# EAGLE design zamek (EAGLE 6.4)
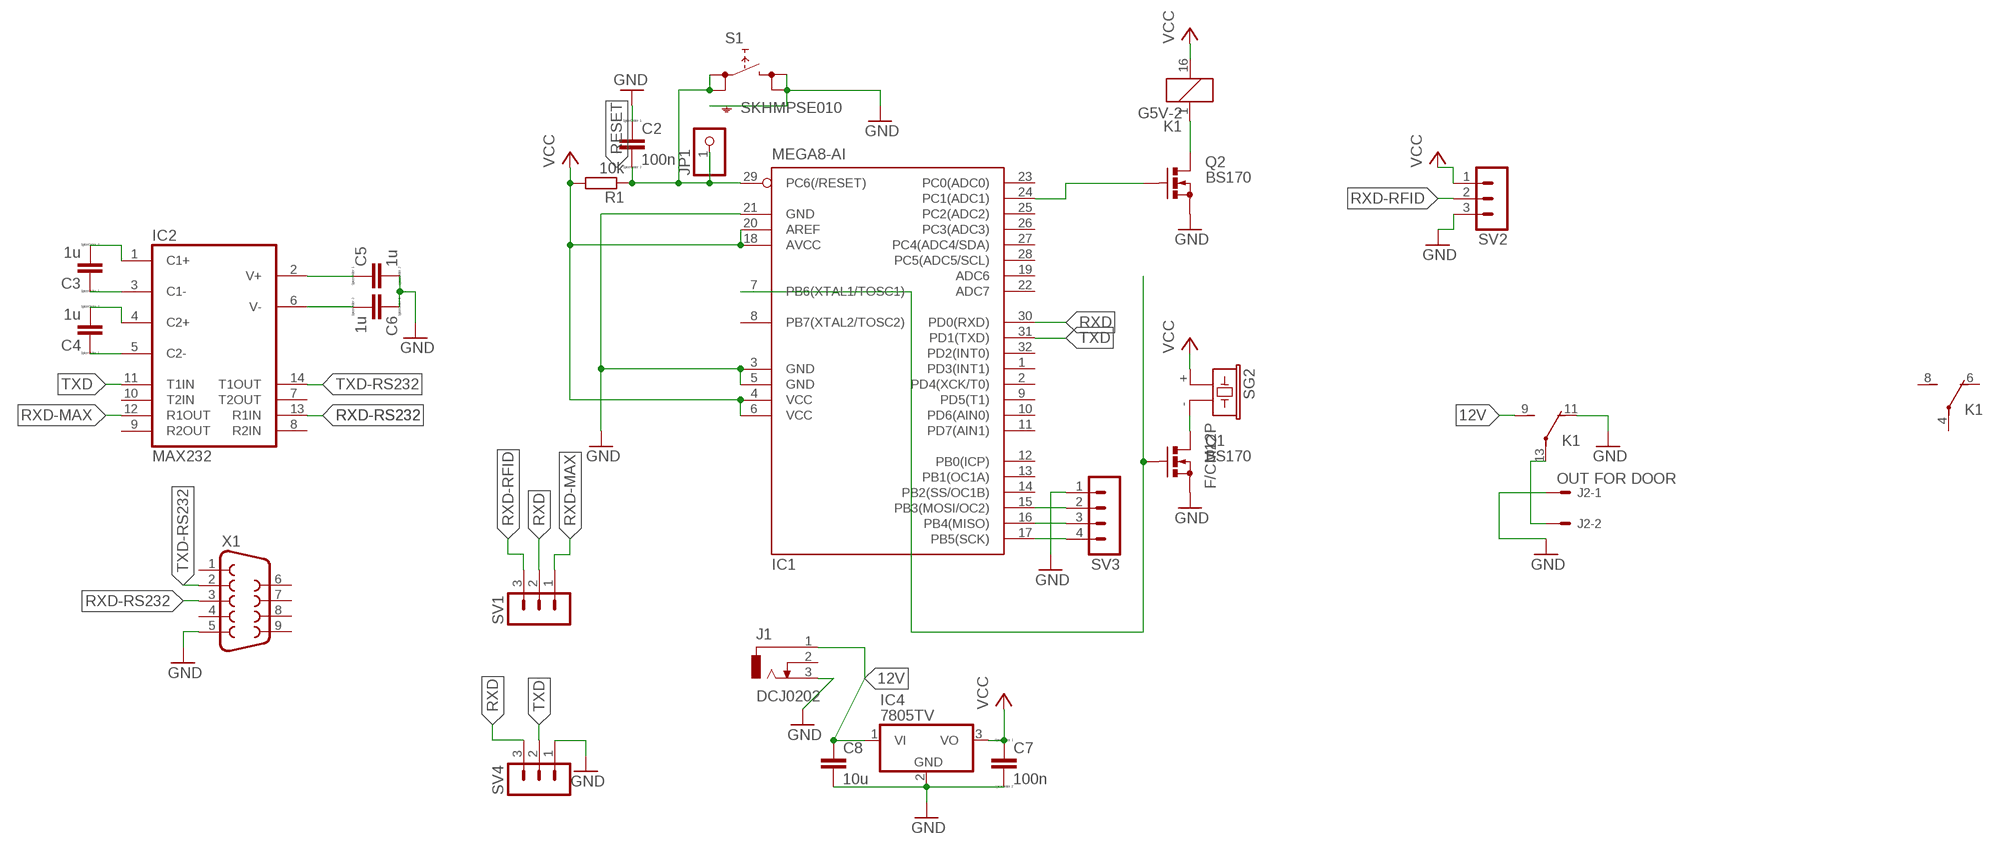
[diagram p0: schematic, sheet 1]

## Parts
C2  100n  CC1206  [C1206]
C3  1u  CC1206  [C1206]
C4  1u  CC1206  [C1206]
C5  1u  CC1206  [C1206]
C6  1u  CC1206  [C1206]
C7  100n  CC1206  [C1206]
C8  10u  C5/3  [C5B3]
IC1  MEGA8-AI  [TQFP32-08]
IC2  MAX232  [DIL16]
IC4  7805TV  [TO220V]
J1  DCJ0202  [DCJ0202]
J2  OUT FOR DOOR  22-27-2021-02  [6410-02]
JP1  PINHD-1X1  [1X01]
K1  G5V-2  [G5V-2]
Q1  BS170  [SOT54E]
Q2  BS170  [SOT54E]
R1  10k  R-EU_R1206  [R1206]
S1  SKHMPSE010  [SKHMPXE010]
SG2  F/CM12P  [F/CM12P]
SV1  MA03-1  [MA03-1]
SV2  MA03-1  [MA03-1]
SV3  MA04-1  [MA04-1]
SV4  MA03-1  [MA03-1]
X1  F09HP  [F09HP]

## Nets
12V: C8.1 IC4.1(VI) J1.1 K1.9(2:S)
GND: C2.1 C5.2 C6.1 C7.2 C8.2 IC1.3(GND) IC1.5(GND) IC1.21(GND) IC4.2(GND) J1.3 J2.1 K1.11(2:O) Q1.S Q2.S S1.3(2.1) S1.4(2.2) S1.5(SH) SV2.3 SV3.1 SV4.1 X1.5
MISO: IC1.16(PB4(MISO)) SV3.3
MOSI: IC1.15(PB3(MOSI/OC2)) SV3.2
N$1: C5.1 IC2.2(V+)
N$2: C6.2 IC2.6(V-)
N$3: C3.1 IC2.3(C1-)
N$4: C4.1 IC2.5(C2-)
N$5: C4.2 IC2.4(C2+)
N$6: C3.2 IC2.1(C1+)
N$7: Q1.D SG2.-
N$8: IC1.24(PC1(ADC1)) Q2.G
N$9: K1.1 Q2.D
N$10: IC1.7(PB6(XTAL1/TOSC1)) Q1.G
N$11: J2.2 K1.13(2:P)
RESET: C2.2 IC1.29(PC6(/RESET)) JP1.1 R1.1 S1.1(1.1) S1.2(1.2)
RXD: IC1.30(PD0(RXD)) SV1.2 SV4.3
RXD-MAX: IC2.12(R1OUT) SV1.1
RXD-RFID: SV1.3 SV2.2
RXD-RS232: IC2.13(R1IN) X1.3
SCK: IC1.17(PB5(SCK)) SV3.4
TXD: IC1.31(PD1(TXD)) IC2.11(T1IN) SV4.2
TXD-RS232: IC2.14(T1OUT) X1.2
VCC: C7.1 IC1.4(VCC) IC1.6(VCC) IC1.18(AVCC) IC1.20(AREF) IC4.3(VO) K1.16 R1.2 SG2.+ SV2.1
Unconnected: IC1.1(PD3(INT1)) IC1.2(PD4(XCK/T0)) IC1.8(PB7(XTAL2/TOSC2)) IC1.9(PD5(T1)) IC1.10(PD6(AIN0)) IC1.11(PD7(AIN1)) IC1.12(PB0(ICP)) IC1.13(PB1(OC1A)) IC1.14(PB2(SS/OC1B)) IC1.19(ADC6) IC1.22(ADC7) IC1.23(PC0(ADC0)) IC1.25(PC2(ADC2)) IC1.26(PC3(ADC3)) IC1.27(PC4(ADC4/SDA)) IC1.28(PC5(ADC5/SCL)) IC1.32(PD2(INT0)) IC2.7(T2OUT) IC2.8(R2IN) IC2.9(R2OUT) IC2.10(T2IN) J1.2 K1.4(1:P) K1.6(1:O) K1.8(1:S) X1.1 X1.4 X1.6 X1.7 X1.8 X1.9

## Power pins joined to a net without a drawn wire
GND: IC2.15(GND)
VCC: IC2.16(VCC)

## Library data of the parts
C2-C7 = eagle-ltspice:C: CAPACITOR, European symbol; SPICEMODEL: NONE; SPICEPREFIX: C
C8 = capacitor-wima:C: CAPACITOR naming: grid - package width
IC1 = atmel:MEGA8: MICROCONTROLLER 8 Kbytes FLASH, 1 kbytes SRAM, 512 bytes EEPROM, USART, 6-channel 10 bit ADC, 2-channel 8 bit ADC Pin compatible with Atmega48, ATMega88, ATMega168 Source: avr.lbr; MPN: ATMEGA8-16AU; OC_FARNELL: 9171371; OC_NEWARK: 73M8863
IC2 = maxim:MAX232: RS232 TRANSEIVER; MF: MAXIM; MPN: MAX232ACPE+; OC_FARNELL: 9723773; OC_NEWARK: 68K4544
IC4 = linear:78*: Positive VOLTAGE REGULATOR Source: http://cache.national.com/ds/LM/LM78L05.pdf http://www.fairchildsemi.com/ds/LM/LM7805.pdf
J1 = con-jack:DCJ0202: DC POWER JACK Source: DCJ0202.pdf; OC_FARNELL: unknown; OC_NEWARK: unknown
J2 = con-molex:22-?-02: CONNECTOR wire to board 2.54 mm (.1 inch) pitch header; OC_FARNELL: unknown; OC_NEWARK: unknown
JP1 = pinhead:PINHD-1X1: PIN HEADER
K1 = relay:G5V-2: OMRON PCB Relay Source: http://www.omron.com/ecb/products/pdf/en-g5v2.pdf; MPN: G5V-2 5DC; OC_FARNELL: 9949488; OC_NEWARK: 78K5703
Q1 Q2 = transistor-small-signal:BS170: N-CHANNEL MOS FET
R1 = rcl:R-EU_: RESISTOR, European symbol
S1 = switch:SKHMP*E010: 6.2 X 6.5mm TACT Switch (SMD) Source: http://www3.alps.co.jp/WebObjects/catalog.woa/PDF/E/Switch/Tact/SKHM/SKHM.PDF
SG2 = buzzer:F/CM12P: BUZZER Source: Buerklin; OC_FARNELL: unknown; OC_NEWARK: unknown
SV1 SV2 SV4 = con-lstb:MA03-1: PIN HEADER; OC_FARNELL: unknown; OC_NEWARK: unknown
SV3 = con-lstb:MA04-1: PIN HEADER; OC_FARNELL: unknown; OC_NEWARK: unknown
X1 = con-subd:F09: SUB-D; OC_FARNELL: unknown; OC_NEWARK: unknown

## Board
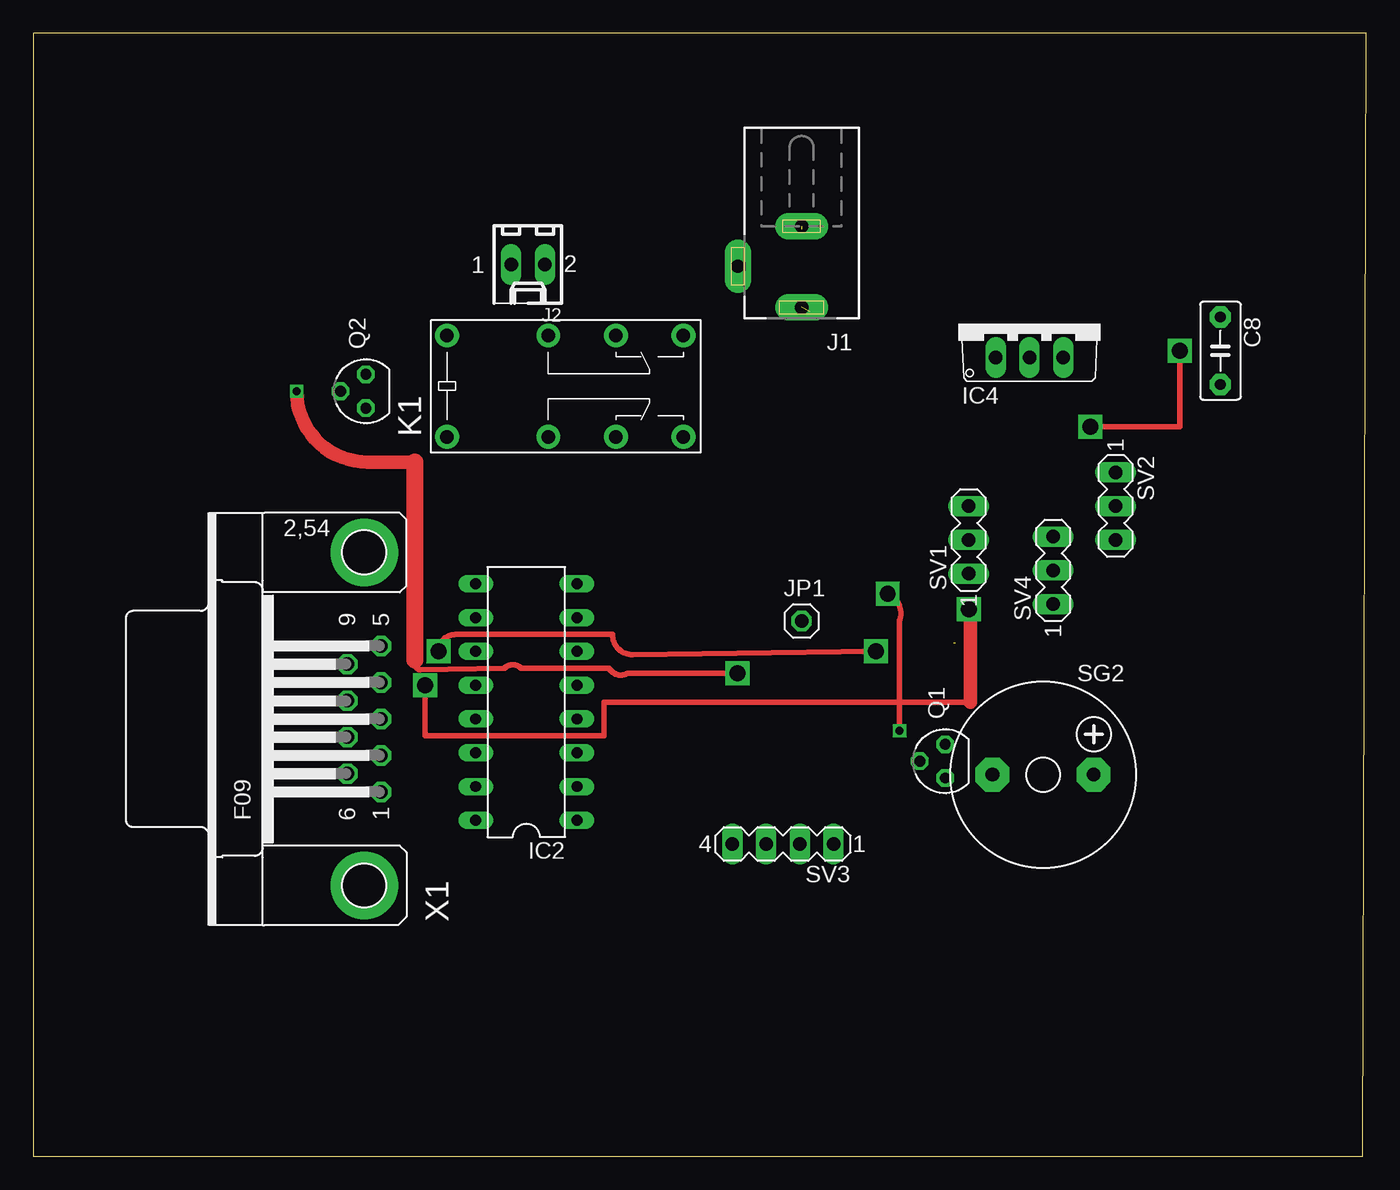
[diagram p1: board, top side]
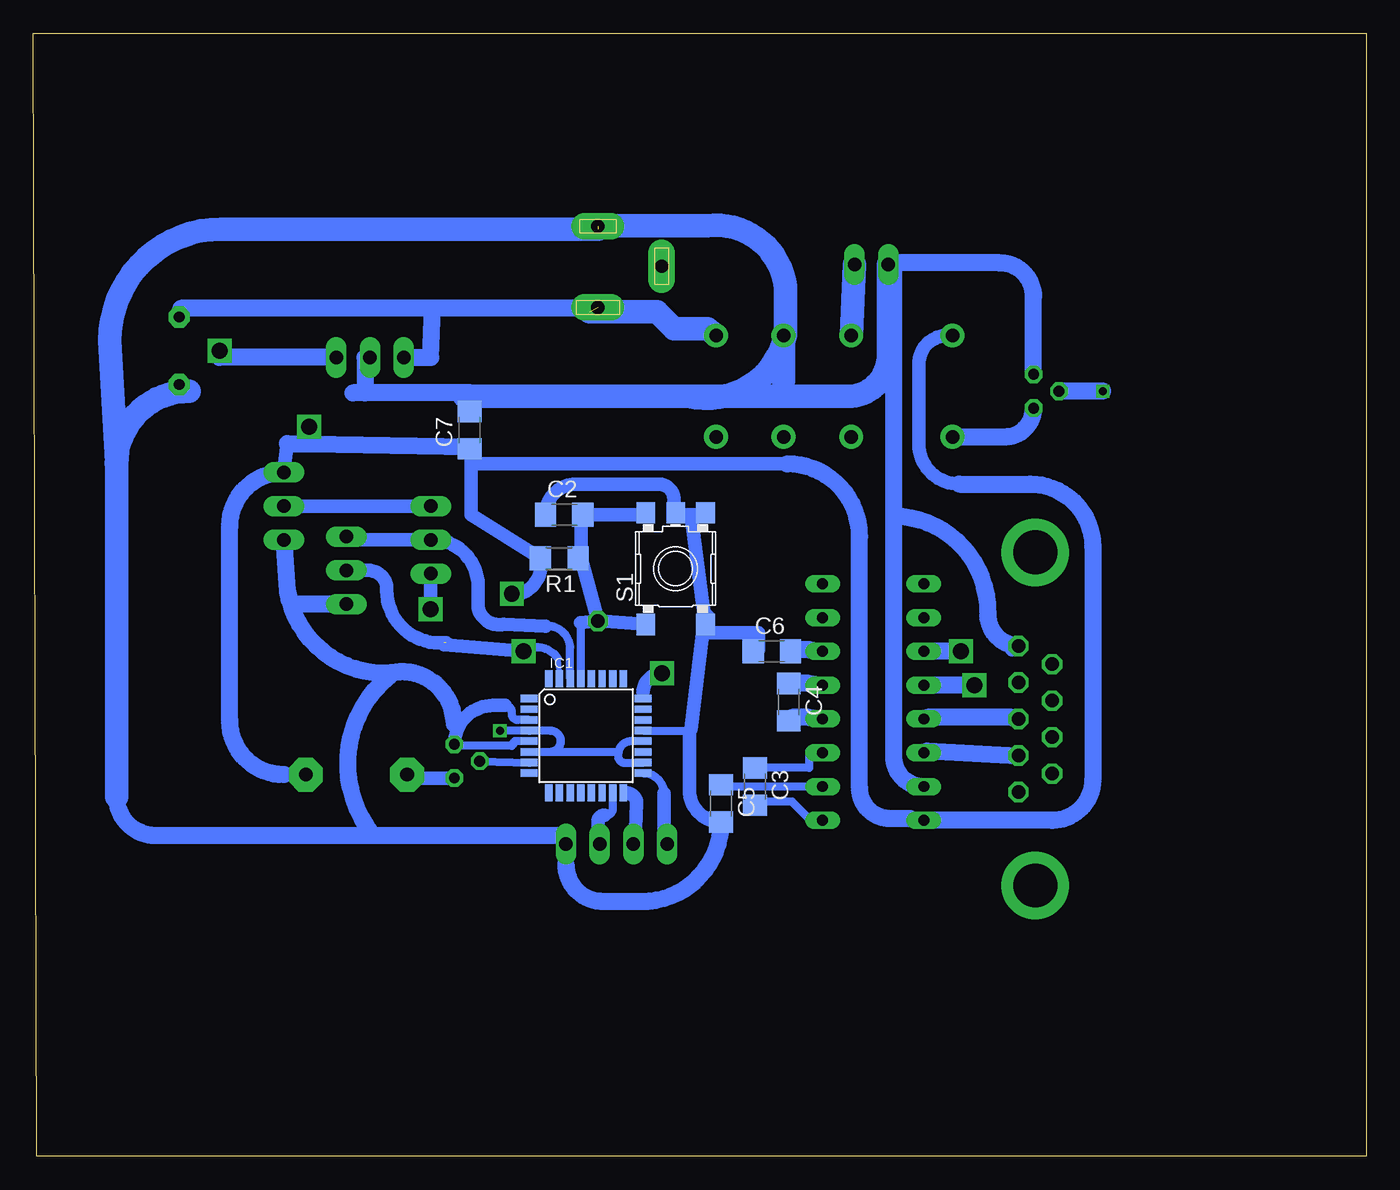
[diagram p2: board, bottom side, seen from below]

Size 100.25 x 84.44 mm. Coordinates in mm from the lower left corner, seen from the top.
Outline: 0,0 100,0 100.25,84.44 0,84.44 0,0
Copper layers (1*16): Top 0.035mm / dielectric 1.5mm / Bottom 0.035mm
Design rules "default *": minimum track width 20mil, minimum drill 24mil, track to track 15mil, track to pad 15mil, pad to pad 15mil, via to via 15mil, smd to smd 8mil, copper to edge 40mil, drill to drill 8mil, minimum pad ring 10mil, minimum via ring 8mil, stop-mask expansion 4mil, vias tented up to drill 0mil, thermal gap 10mil

### Footprints (pad centres in the part's own frame; a part is rotated, then mirrored left to right if it is on the bottom)
C1206 = smd 1.6 x 1.8: 1 -1.4,0; 2 1.4,0
C5B3 = drill 0.813 pad 1.6 octagon: 1 -2.54,0; 2 2.54,0
TQFP32-08 = smd 1.27 x 0.559: 1 -4.293,2.8; 2 -4.293,2; 3 -4.293,1.2; 4 -4.293,0.4; 5 -4.293,-0.4; 6 -4.293,-1.2; 7 -4.293,-2; 8 -4.293,-2.8; 17 4.293,-2.8; 18 4.293,-2; 19 4.293,-1.2; 20 4.293,-0.4; 21 4.293,0.4; 22 4.293,1.2; 23 4.293,2; 24 4.293,2.8 | smd 0.559 x 1.27: 9 -2.8,-4.293; 10 -2,-4.293; 11 -1.2,-4.293; 12 -0.4,-4.293; 13 0.4,-4.293; 14 1.2,-4.293; 15 2,-4.293; 16 2.8,-4.293; 25 2.8,4.293; 26 2,4.293; 27 1.2,4.293; 28 0.4,4.293; 29 -0.4,4.293; 30 -1.2,4.293; 31 -2,4.293; 32 -2.8,4.293
DIL16 = drill 0.813 long: 1 -8.89,-3.81; 2 -6.35,-3.81; 3 -3.81,-3.81; 4 -1.27,-3.81; 5 1.27,-3.81; 6 3.81,-3.81; 7 6.35,-3.81; 8 8.89,-3.81; 9 8.89,3.81; 10 6.35,3.81; 11 3.81,3.81; 12 1.27,3.81; 13 -1.27,3.81; 14 -3.81,3.81; 15 -6.35,3.81; 16 -8.89,3.81
TO220V = drill 1.016 long: 1 -2.54,-2.54; 2 0,-2.54; 3 2.54,-2.54
DCJ0202 = drill 1 pad 2 long: 1 0,3.1; 2 4.8,0; 3 0,-3
6410-02 = drill 1.016 long: 1 1.27,0; 2 -1.27,0
1X01 = drill 1.016 octagon: 1 0,0
G5V-2 = drill 1 pad 1.8: 1 -8.89,-3.81; 4 -1.27,-3.81; 6 3.81,-3.81; 8 8.89,-3.81; 9 8.89,3.81; 11 3.81,3.81; 13 -1.27,3.81; 16 -8.89,3.81
SOT54E = drill 0.813 octagon: D -1.27,0; G 0,1.905; S 1.27,0
R1206 = smd 1.6 x 1.803: 1 -1.422,0; 2 1.422,0
SKHMPXE010 = smd 1.6 x 1.4: 1 -4.2,2.25; 2 4.2,2.25; 3 -4.2,-2.25; 4 4.2,-2.25; 5 4.2,0
F/CM12P = drill 1.016 pad 2.54 octagon: + 3.81,0; - -3.81,0
MA03-1 = drill 1.016 long: 1 -2.54,0; 2 0,0; 3 2.54,0
MA04-1 = drill 1.016 long: 1 -3.81,0; 2 -1.27,0; 3 1.27,0; 4 3.81,0
F09HP = drill 1.016 octagon: 1 -5.486,-1.27; 2 -2.743,-1.27; 3 0,-1.27; 4 2.743,-1.27; 5 5.486,-1.27; 6 -4.115,1.27; 7 -1.372,1.27; 8 1.372,1.27; 9 4.115,1.27 | drill 3.302 pad 5.08: G1 -12.522,0; G2 12.522,0

### Placement (x,y rotation side)
C2  60.33,48.26 0 bottom
C3  45.97,27.81 270 bottom
C4  43.43,34.16 270 bottom
C5  48.51,26.54 270 bottom
C6  44.7,37.97 0 bottom
C7  67.44,54.61 90 bottom
C8  89.28,60.58 270 top
IC1  58.67,31.62 0 bottom
IC2  37.08,34.16 90 top
IC4  74.93,62.61 0 top
J1  57.78,66.93 180 top
J2  37.21,67.06 180 top
JP1  57.78,40.26 0 top
K1  40.01,57.91 0 top
Q1  68.58,29.72 90 top
Q2  25.02,57.53 90 top
R1  60.71,44.96 180 bottom
S1  51.94,44.2 90 bottom
SG2  75.95,28.7 0 top
SV1  70.36,46.35 90 top
SV2  81.41,48.9 270 top
SV3  56.39,23.5 180 top
SV4  76.71,44.07 90 top
X1  24.89,32.89 90 top

### Tracks (layer width: path | path; a pad name or v marks a point on that pad's centre or on a via)
12V  (1 unrouted)
  Bottom 0.406: J1.1 65.79,63.7 57.53,63.75
  Bottom 1.27: 57.53,63.75 70.23,63.75 | 70.23,63.75 89.15,63.75 C8.1 | IC4.1 70.36,60.07 70.23,63.75
  Bottom 1.778: 58.42,63.5 53.34,63.5 52.07,62.23 49.53,62.23 K1.9
GND  (1 unrouted)
  Bottom 0.406: 50.91,32.02 arc-90 50.8,32.13 | 64.26,33.27 64.26,33.4 | 64.03,31.22 arc-90 64.14,31.11 | 64.14,30.99 arc90 64.26,30.86 | 68.45,30.86 arc90 Q1.S 68.58,32.51 | 35.81,67.18 arc-90 J2.1 | 43.81,57.78 arc90 44.45,57.15 | 43.69,58.42 arc-90 43.81,58.29 | IC4.2 75.31,60.07 | 89.28,57.23 C8.2 | 52.58,56.64 53.21,56.64 53.21,57.15 | 67.82,57.15 67.82,57.4 | 58.42,57.15 50.93,57.15 | 57.74,69.98 arc-90 J1.3
  Bottom 0.508: 49.53,39.37 S1.3 | 45.72,38.1 C6.1 | 49.53,48.26 S1.4 | 52.07,48.26 S1.5 | 49.78,40.51 49.53,40.64 | 72.64,36.45 72.39,36.83 | 34.29,27.94 IC2.15 | 26.67,38.1 X1.5 | 48.26,25.4 C5.2
  Bottom 0.61: IC1.21 50.91,32.02 | IC1.3 63.81,32.82 arc90 64.26,33.27 | 64.26,33.4 arc-90 64.77,33.91 | IC1.5 64.03,31.22 | 64.14,31.11 64.14,30.99 | 64.26,30.86 68.45,30.86
  Bottom 1.016: 49.53,39.37 45.72,39.37 45.72,38.1 | 50.8,48.26 52.07,48.26 52.07,49.4 arc-90 53.21,50.55 59.44,50.55 arc-90 C2.1 | 50.8,48.26 49.53,48.26 | 50.8,48.26 49.78,40.51 50.8,32.13 | 49.53,40.64 S1.3 | 35.94,66.93 J2.1 arc90 35.56,66.67 | 64.77,33.91 65.66,33.91 arc-90 Q1.S | 43.81,58.29 43.81,57.78 | 66.48,56.97 arc-90 C7.2 | C7.2 arc-90 67.31,56.14 67.31,57.4 arc-90 67.44,57.28 C7.2 | 50.91,32.02 50.91,27.54 arc-90 C5.2 | 60.2,21.97 SV3.1 60.2,23.88 arc-90 60.45,24.13 | 73.41,36.2 arc32 73.15,36.45 | 73.15,36.45 arc58 72.52,36.45 72.64,36.45 | 72.64,36.45 73.15,36.45 | 73.15,36.45 arc90 72.64,36.45 | 26.67,38.1 26.04,38.35 | 28.45,40.77 28.45,40.89 | 80.64,41.53 arc90 81.15,42.55 | 74.55,24.13 arc-90 74.68,24.13 74.55,24.13 | 88.52,57.53 89.53,57.53 arc-90 89.66,57.4 89.41,57.4 arc90 89.28,57.28 88.77,57.28 arc-90 88.52,57.53
  Bottom 1.27: 35.56,66.67 35.56,48.13 | 68.58,32.51 arc-90 72.64,36.45 arc90 81.15,42.55 SV2.3 | Q2.S 25.02,64.64 arc-90 27.56,67.18 35.81,67.18 | 74.68,24.13 91.06,24.13 arc90 93.98,27.05 | C8.2 88.52,57.53 | 67.31,57.4 67.82,57.4 75.31,57.4 | 75.31,57.4 76.2,57.4 | 60.2,21.97 arc-90 57.4,19.18 54.48,19.18 arc-90 C5.2 | 60.45,24.13 74.68,24.13 | 74.68,24.13 arc90 73.41,36.2 | 26.04,38.35 arc90 28.45,40.77 | 28.45,40.89 arc-90 35.56,48.13 | SV4.1 80.64,41.53 | 35.56,48.13 35.56,30.1 arc-90 IC2.15 | 75.31,60.07 75.31,57.4
  Bottom 1.778: 50.93,57.15 44.45,57.15 38.99,57.15 arc-90 35.94,60.2 J2.1 | 50.93,57.15 53.21,57.15 58.42,57.15 67.82,57.15 | K1.11 43.81,58.29 | 93.98,27.05 93.98,52.07 | 93.98,52.07 arc90 88.52,57.53 | 50.93,57.15 arc-90 43.69,61.72 43.69,65.41 arc-90 49.53,69.98 57.74,69.98 | 57.78,69.72 86.11,69.72 arc-90 94.49,61.34 93.98,52.2 arc-90 93.98,52.07
MISO
  Bottom 0.406: IC1.16 55.65,27.33 | 54.99,23.62 arc90 SV3.3
  Bottom 1.016: 55.65,27.33 arc90 54.86,26.54 54.99,23.62
MOSI
  Bottom 0.406: 57.15,25.65 57.28,25.65 | 57.78,23.62 arc-90 SV3.2
  Bottom 0.61: IC1.15 56.67,26.13 arc90 57.15,25.65
  Bottom 1.016: 57.28,25.65 arc-90 57.78,25.15 57.78,23.62
N$1
  Bottom 0.61: IC2.2 48.38,27.81 arc90 C5.1
N$2
  Bottom 0.508: 43.18,38.1 C6.2
  Bottom 1.27: 43.18,38.1 41.91,38.1 IC2.6
N$3
  Bottom 0.508: 45.72,29.21 C3.1 | 41.91,30.48 IC2.3
  Bottom 0.61: 41.91,30.48 41.91,29.21 45.72,29.21
N$4
  Bottom 0.508: 43.18,35.56 C4.1
  Bottom 1.27: 43.18,35.56 41.91,35.56 IC2.5
N$5
  Bottom 0.508: 43.18,33.02 C4.2
  Bottom 1.27: 43.18,33.02 41.91,33.02 IC2.4
N$6
  Bottom 0.508: 45.72,26.67 C3.2 | 41.91,25.4 IC2.1
  Bottom 0.61: 45.72,26.67 43.18,26.67 41.91,25.4
N$7
  Bottom 1.016: Q1.D 72.14,28.45 SG2.-
N$8  (via drill 0.6, 1.2)
  Top 0.406: v52.96,36.32 44.7,36.32 arc-90 43.31,36.7 36.7,36.7 arc90 35.43,36.7 29.08,36.58 arc-90 28.7,37.34
  Top 1.016: 28.7,52.2 25.15,52.2 arc-90 v19.81,57.53
  Top 1.27: 28.7,37.34 28.7,52.2
  Bottom 0.61: IC1.24 54.38,34.9
  Bottom 1.016: 54.38,34.9 arc90 v52.96,36.32
  Bottom 1.27: v19.81,57.53 Q2.G
N$9
  Bottom 1.27: K1.1 27.18,54.1 arc-90 Q2.D
N$10
  Bottom 0.406: 62.94,29.59 arc90 IC1.7
  Bottom 0.61: Q1.G 62.94,29.59
N$11
  Bottom 1.778: K1.13 J2.2
RESET
  Bottom 0.508: 54.61,48.26 S1.2 | 54.23,40.01 S1.1 | 59.05,48.26 C2.2 | 59.05,44.96 R1.1
  Bottom 0.61: 59.07,40.11 IC1.29
  Bottom 1.016: JP1.1 59.07,40.11 | C2.2 54.61,48.26 | JP1.1 54.23,40.01 | JP1.1 59.05,44.96 59.05,48.26
RXD
  Bottom 0.406: SV1.2 70.23,46.35
  Bottom 0.61: IC1.30 59.87,38.28 arc-90 61.72,39.88
  Bottom 1.016: 70.23,46.35 arc90 66.8,42.93 66.8,41.27 arc-90 64.9,40.01 61.72,39.88 | SV1.2 76.45,46.35 arc90 SV4.3
RXD-MAX  (via drill 1.2)
  Top 0.406: v70.36,41.15 70.48,40.77 | 70.48,34.16 42.93,34.16 42.93,31.62 29.46,31.62 v29.46,35.43 29.34,35.31
  Top 1.016: 70.48,40.77 70.48,34.16
  Bottom 1.016: SV1.1 70.36,41.02 arc90 v70.36,41.15
  Bottom 1.27: v29.46,35.43 IC2.12
RXD-RFID
  Bottom 1.016: SV2.2 SV1.3
RXD-RS232
  Bottom 0.508: 33.02,33.02 IC2.13
  Bottom 1.016: 26.67,33.02 X1.3
  Bottom 1.27: 26.67,33.02 33.02,33.02
SCK
  Bottom 0.61: IC1.17 54.35,28.82 arc90 52.83,27.3
  Bottom 0.813: 52.83,23.75 arc-90 SV3.4
  Bottom 1.016: 52.83,27.3 52.83,23.75
TXD  (via drill 1.2)  (1 unrouted)
  Top 0.406: v63.37,37.97 45.09,37.72 arc-90 43.56,39.24 31.75,39.24 arc90 v30.48,37.97
  Bottom 0.406: IC1.31 60.8,37.43
  Bottom 0.61: 60.8,37.43 arc-90 v63.37,37.97
  Bottom 1.016: v63.37,37.97 69.34,38.48 arc90 69.22,38.61 68.96,38.48 | 69.34,38.61 69.72,38.61 arc90 73.66,42.55 73.66,42.67 arc-90 75.06,44.07 SV4.2
  Bottom 1.27: v30.48,37.97 IC2.11
TXD-RS232
  Bottom 0.508: 33.02,30.48 IC2.14
  Bottom 1.016: 26.16,30.1 X1.2
  Bottom 1.27: 26.16,30.1 33.02,30.48
VCC  (via drill 0.6, 1.2)
  Top 0.406: v65.15,32 65.15,40.26 arc90 v64.26,42.29 | v79.5,54.86 86.23,54.86 v86.23,60.58
  Bottom 0.406: 56.26,30.1 56.26,30.23 arc-90 56.46,30.42 | 54.41,29.59 arc-90 IC1.18 | 62.95,32 arc90 IC1.4 | 65.13,32.02 arc-90 v65.15,32 | 86.23,60.07 v86.23,60.58
  Bottom 0.508: 62.1,44.96 R1.2 | 67.31,53.34 C7.1 | 34.29,25.4 IC2.16
  Bottom 0.61: IC1.20 55.26,31.22 arc-90 56.26,30.23 | 56.26,30.1 arc-90 55.75,29.59 54.41,29.59 | 62.95,32 61.34,32 arc90 60.58,31.24 arc90 61.4,30.42 IC1.6 56.46,30.42 | IC1.4 65.13,32.02
  Bottom 1.016: 76.07,53.47 81.15,53.59 SV2.1 | 62.1,44.96 67.31,48.26 67.31,52.07 | 67.31,53.34 67.31,52.07 | 67.31,52.07 43.56,52.07 | v64.26,42.29 63.78,42.29 arc-90 R1.2 | SG2.+ 81.41,28.7 | K1.16 31.5,61.72 arc-90 33.66,59.56 33.66,53.59 arc-90 30.61,50.55
  Bottom 1.27: 81.15,53.59 79.5,53.59 | 79.5,53.59 67.31,53.34 | v79.5,54.86 79.5,53.59 | 43.56,52.07 arc90 38.1,46.61 38.1,27.69 arc-90 35.81,25.4 34.29,25.4 | 81.41,28.7 arc90 85.47,32.77 85.47,47.37 arc90 SV2.1 | 30.61,50.55 25.27,50.55 arc90 20.57,45.85 20.57,28.32 arc90 23.62,25.27 IC2.16 | IC4.3 86.23,60.07